# Altium schematic sheet Microcontroller.SchDoc
size A
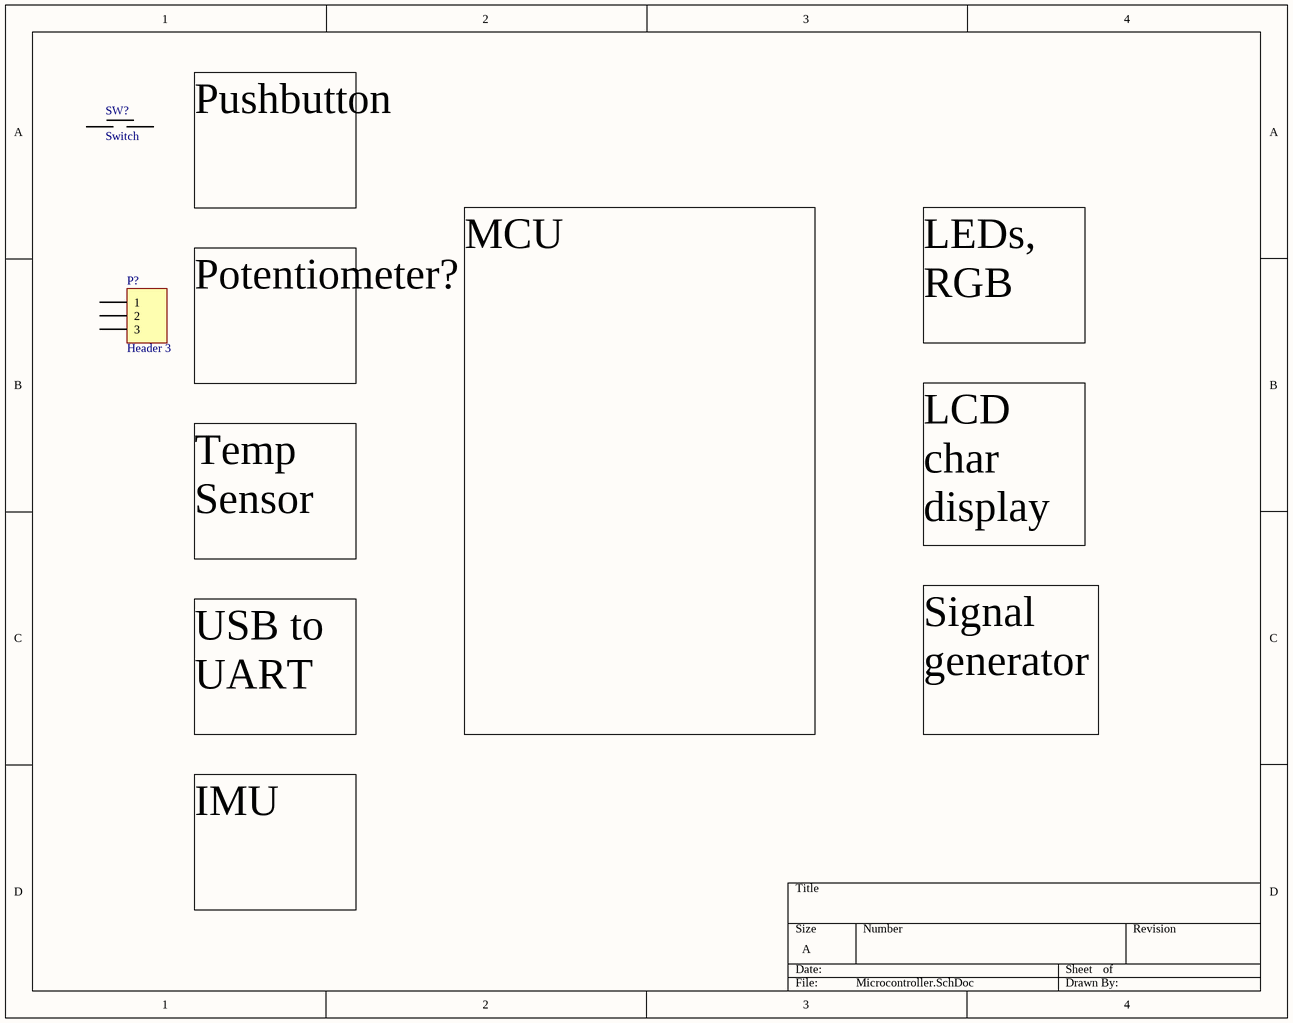
[diagram p0: Microcontroller.SchDoc]

## Parts
P?  Header 3  [HDR1X3]
SW?  Switch  [Amazon THT Switch]

## Nets
1: SW?.2
4: SW?.4

Not connected (* = marked no-connect by the designer): P? 1 2 3; SW? 1 3

## Notes on the sheet
- Pushbutton
- LEDs,
  RGB
- Potentiometer?
- Temp
  Sensor
- LCD char display
- USB to
  UART
- MCU
- Signal generator
- IMU

## Library data of the parts
P? = Header 3: Header, 3-Pin; LatestRevisionDate: 17-Jul-2002; LatestRevisionNote: Re-released for DXP Platform.; Publisher: Altium Limited
SW? = Switch: Manufacturer Part No.: PTS645SM43SMTR92 LFS; Digi-Key Part No.: CKN9112CT-ND